# Altium schematic sheet POWER.SchDoc: POWER
size A4; DocumentNumber: 10; Revision: 2.0; SheetNumber: 10; SheetTotal: 18
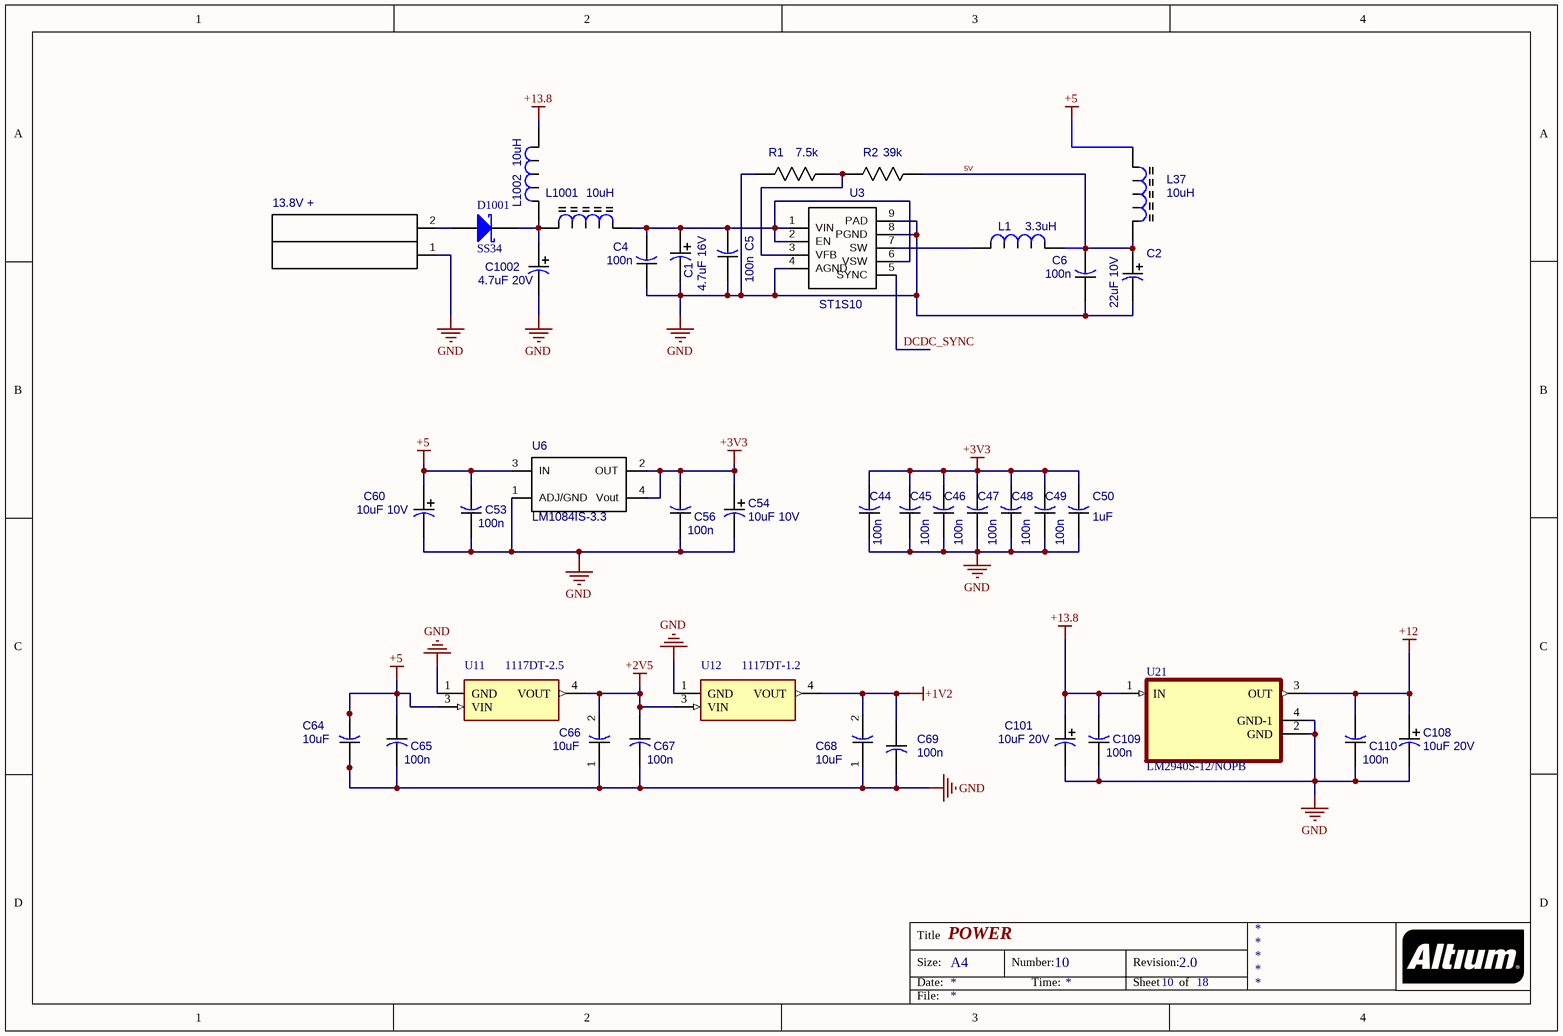
[diagram p0: POWER.SchDoc]

## Parts
13.8V_+  JX2  [JX2]  (value not drawn)
C1  4.7uF 16V  [TANTAL_B]
C2  22uF 10V  [CAPAE_4.3x4.3h5.4]
C4  100n  [CAP_0805]
C5  100n  [CAP_0805]
C6  100n  [CAP_0805]
C44  100n  [CAP_0805]
C45  100n  [CAP_0805]
C46  100n  [CAP_0805]
C47  100n  [CAP_0805]
C48  100n  [CAP_0805]
C49  100n  [CAP_0805]
C50  value 1uF  [CAP_0805]  (hidden comment: 10uF)
C53  100n  [CAP_0805]
C54  10uF 10V  [CAPAE_4.3x4.3h5.4]
C56  100n  [CAP_0805]
C60  10uF 10V  [CAPAE_4.3x4.3h5.4]
C64  10uF  [CAP_0805]
C65  100n  [CAP_0805]
C66  10uF  [CAP_0805]
C67  100n  [CAP_0805]
C68  10uF  [CAP_0805]
C69  100n  [CAP_0805]
C101  10uF 20V  [CAPAE_4.3x4.3h5.4]
C108  10uF 20V  [CAPAE_4.3x4.3h5.4]
C109  100n  [CAP_0805]
C110  100n  [CAP_0805]
C1002  value 4.7uF 20V  [CAPAE_4.3x4.3h5.4]  (hidden comment: 10uF 10V)
D1001  SS34  [SMB]
L1  3.3uH  [IND_1812]
L37  10uH  [IND_7x7]
L1001  10uH  [IND_7x7]
L1002  10uH  [IND_1812]
R1  7.5k  [RES_0805]
R2  39k  [RES_0805]
U3  ST1S10  [ST1S10]
U6  LM1084IS-3.3  [LM1085-3.3]
U11  1117DT-2.5  [TO228P991X238-3N]
U12  1117DT-1.2  [TO228P991X238-3N]
U21  LM2940S-12/NOPB  [TO254P1524X483-4N]

## Nets
+1V2: C68.2 C69.1 U12.4(VOUT)
+2V5: C66.2 C67.1 U11.4(VOUT) U12.3(VIN)
+3V3: C44.2 C45.2 C46.2 C47.2 C48.2 C49.2 C50.2 C54.1(PLUS) C56.2 U6.2(OUT) U6.4(Vout)
+5: C53.2 C60.1(PLUS) C64.2 C65.1 L37.1(A) U6.3(IN) U11.3(VIN)
+12: C108.1(PLUS) C110.2 U21.3(OUT)
+13.8: C101.1(PLUS) C109.2 L1002.2 U21.1(IN)
GND: 13.8V_+.1 C1.2(MINUS) C2.2(MINUS) C4.1 C5.1 C6.1 C44.1 C45.1 C46.1 C47.1 C48.1 C49.1 C50.1 C53.1 C54.2(MINUS) C56.1 C60.2(MINUS) C64.1 C65.2 C66.1 C67.2 C68.1 C69.2 C101.2(MINUS) C108.2(MINUS) C109.1 C110.1 C1002.2(MINUS) R1.1 U3.4(AGND) U3.8(PGND) U3.9(PAD) U6.1(ADJ/GND) U11.1(GND) U12.1(GND) U21.2(GND) U21.4(GND-1)
5V: C2.1(PLUS) C6.2 L1.2 L37.2(B) R2.2
DCDC_SYNC: U3.5(SYNC)
Net13.8V_+_2: 13.8V_+.2 D1001.1(A)
NetC1_1: C1.1(PLUS) C4.2 C5.2 L1001.2(B) U3.1(VIN) U3.2(EN) U3.6(VSW)
NetC1002_1: C1002.1(PLUS) D1001.2(K) L1001.1(A) L1002.1
NetL1_1: L1.1 U3.7(SW)
NetR1_2: R1.2 R2.1 U3.3(VFB)

## Notes on the sheet
- Title
- Size:
- Date:
- A4
- Number:
- Time:
- Revision:
- Sheet
- of
- File:

## Library data of the parts
C1 = CAPAE_6.6x6.6h5.4: Value: 4.7uF 16V
C2 C54 C60 C101 C108 C1002 = CAPAE_4.3x4.3h5.4
  C2: Value: 22uF 10V
  C54 C60: Value: 10uF 10V
  C101 C108: Value: 10uF 20V
C4-C6 C44-C50 C53 C56 C64-C69 C109 C110 = CAP_0805
  C4-C6 C44-C49 C53 C56 C65 C67 C69 C109 C110: Value: 100n
  C64 C66 C68: Value: 10uF
D1001 = D Schottky: Schottky Diode; Published: 8-Jun-2000; LatestRevisionDate: 17-Jul-2002; LatestRevisionNote: Re-released for DXP Platform.; PackageReference: SMB; Publisher: Altium Limited; PackageDescription: DO-214-AA/SMB; 2 C-Bend Leads; Body 5.3 x 3.6 mm, inc. leads (LxW); Code_JEDEC: DO-214-AA
L1 L1002 = IND_1812
  L1: Value: 3.3uH
  L1002: Value: 10uH
L37 L1001 = IND_FERRITE_CORE: Inductor; Value: 10uH
R1 R2 = RES_0805
  R1: Value: 7.5k
  R2: Value: 39k
U6 = LM1085-3.3
U11 = LM1117DT-ADJ: LD1117DT-2.5 DPAK; Manufacturer_Name: Texas Instruments; Datasheet Link: http://www.ti.com/lit/ds/symlink/lm1117-n.pdf; Height: 2.38mm; Manufacturer_Part_Number: LM1117DT-ADJ; Mouser Part Number: 926-LM1117DT-ADJ; Mouser Price/Stock: https://www.mouser.com/Search/Refine.aspx?Keyword=926-LM1117DT-ADJ
U12 = LM1117DT-ADJ: LD1117DT-1.2 DPAK; Manufacturer_Name: Texas Instruments; Datasheet Link: http://www.ti.com/lit/ds/symlink/lm1117-n.pdf; Height: 2.38mm; Manufacturer_Part_Number: LM1117DT-ADJ; Mouser Part Number: 926-LM1117DT-ADJ; Mouser Price/Stock: https://www.mouser.com/Search/Refine.aspx?Keyword=926-LM1117DT-ADJ
U21 = LM2940S-12/NOPB: 1-A, 26-V, high-PSRR, low-dropout voltage regulator; MF: Texas Instruments; Price: None; Package: TO-263-3 Texas Instruments; Check_prices: https://www.snapeda.com/parts/LM2940S-12/NOPB/Texas+Instruments/view-part/?ref=eda; Availability: In Stock; MP: LM2940S-12/NOPB; Value: *; SnapEDA_Link: https://www.snapeda.com/parts/LM2940S-12/NOPB/Texas+Instruments/view-part/?ref=snap; Purchase-URL: https://pricing.snapeda.com/search/part/LM2940S-12/NOPB/?ref=eda
U3 = ST1S10: Value: ST1S10